# EAGLE design CouchProtato-BOTTOM (EAGLE 9.5.2)
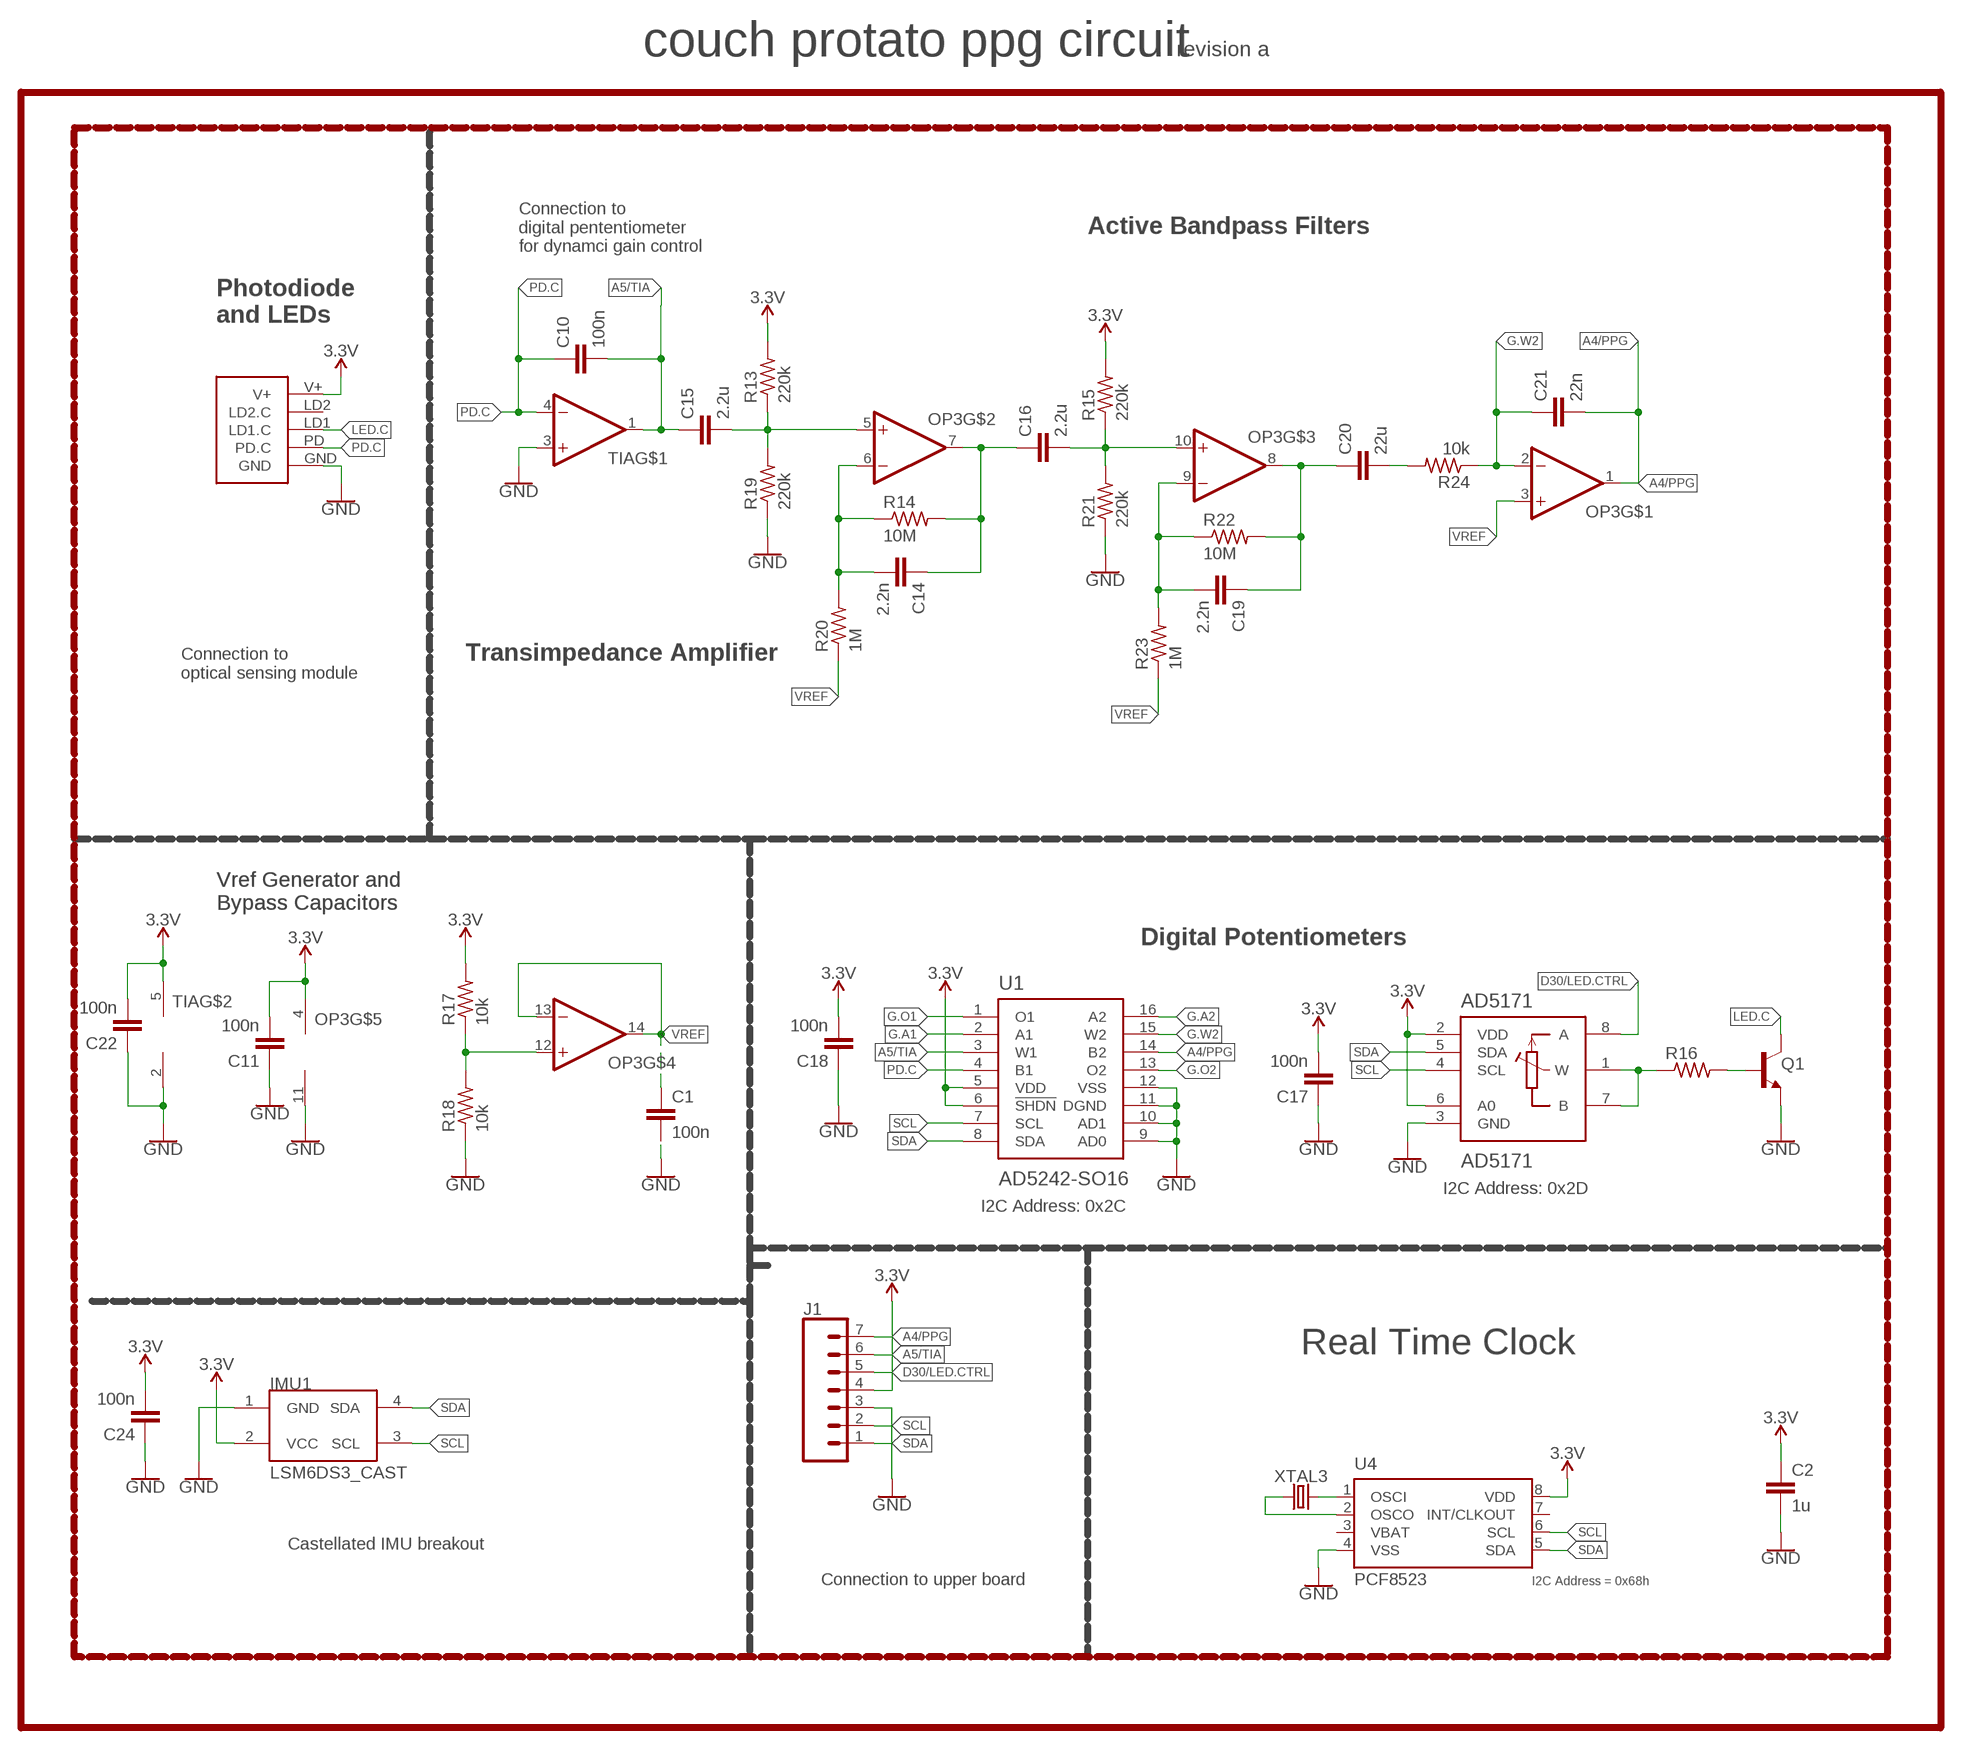
[diagram p0: schematic, sheet 1]

## Parts
AD5171  AD5171  [SOT-23-8]
C1  100n  CAPACITOR0603  [C0603]
C2  1u  CAPACITOR0603  [C0603]
C10  100n  CAPACITOR0603  [C0603]
C11  100n  CAPACITOR0603  [C0603]
C14  2.2n  CAPACITOR0603  [C0603]
C15  2.2u  CAPACITOR0603  [C0603]
C16  2.2u  CAPACITOR0603  [C0603]
C17  100n  CAPACITOR0603  [C0603]
C18  100n  CAPACITOR0603  [C0603]
C19  2.2n  CAPACITOR0603  [C0603]
C20  22u  CAPACITOR0603  [C0603]
C21  22n  CAPACITOR0603  [C0603]
C22  100n  CAPACITOR0603  [C0603]
C24  100n  CAPACITOR0603  [C0603]
IMU1  LSM6DS3_CAST  [LSM6DS3_CAST]
J1  CONN_07-1.27MM  [1X07_1.27MM]
OP3  OP-QUAD-SO14  [SO14]
Q1  NPN-GENERIC  [SOT23-3]
R13  220k  RESISTOR0603  [R0603]
R14  10M  RESISTOR0603  [R0603]
R15  220k  RESISTOR0603  [R0603]
R16  RESISTOR0603  [R0603]
R17  10k  RESISTOR0402  [R0402]
R18  10k  RESISTOR0402  [R0402]
R19  220k  RESISTOR0603  [R0603]
R20  1M  RESISTOR0603  [R0603]
R21  220k  RESISTOR0603  [R0603]
R22  10M  RESISTOR0603  [R0603]
R23  1M  RESISTOR0603  [R0603]
R24  10k  RESISTOR0603  [R0603]
TIA  OP-SINGLEOT  [SOT23-5]
U1  AD5242-SO16  [SO16]
U4  PCF8523  [SO8]
U$3  PPG.MODULE.2  [PPG.MODULE.2]
XTAL3  32.7680kHz  CRYSTALECS-.327-12.5-12-C-TR  [2-SMD.NOLEAD.2.0MMTO1.2MM]

## Nets
3.3V: AD5171.2(VDD) AD5171.6(A0) C2.1 C11.2 C17.2 C18.2 C22.2 C24.2 IMU1.2(VCC) J1.4 OP3.4(V+) R13.2 R15.2 R17.2 TIA.5(V+) U1.5(VDD) U1.6(!SHDN) U4.8(VDD) U$3.V+
A4/PPG: C21.2 J1.7 OP3.1(OUT) U1.14(B2)
A5/TIA: C10.2 C15.1 J1.6 TIA.1(OUT) U1.3(W1)
D30/LED.CTRL: AD5171.8(A) J1.5
G.A1: U1.2(A1)
G.A2: U1.16(A2)
G.O1: U1.1(O1)
G.O2: U1.13(O2)
G.W2: C21.1 OP3.2(-IN) R24.1 U1.15(W2)
GND: AD5171.3(GND) C1.2 C2.2 C11.1 C17.1 C18.1 C22.1 C24.1 IMU1.1(GND) J1.3 OP3.11(V-) Q1.2(E) R18.1 R19.1 R21.1 TIA.2(V-) TIA.3(+IN) U1.9(AD0) U1.10(AD1) U1.11(DGND) U1.12(VSS) U4.4(VSS) U$3.GND
LED.C: Q1.3(C) U$3.LD1(LD1.C)
N$1: U4.2(OSCO) XTAL3.P$1
N$2: U4.1(OSCI) XTAL3.P$2
N$8: Q1.1(B) R16.2
N$9: AD5171.1(W) AD5171.7(B) R16.1
N$10: OP3.12(+IN) R17.1 R18.2
N$13: C15.2 OP3.5(+IN) R13.1 R19.2
N$15: C14.2 OP3.6(-IN) R14.1 R20.2
N$16: C14.1 C16.1 OP3.7(OUT) R14.2
N$17: C16.2 OP3.10(+IN) R15.1 R21.2
N$18: C19.2 OP3.9(-IN) R22.1 R23.2
N$19: C19.1 C20.1 OP3.8(OUT) R22.2
N$20: C20.2 R24.2
PD.C: C10.1 TIA.4(-IN) U1.4(B1) U$3.PD(PD.C)
SCL: AD5171.4(SCL) IMU1.3(SCL) J1.2 U1.7(SCL) U4.6(SCL)
SDA: AD5171.5(SDA) IMU1.4(SDA) J1.1 U1.8(SDA) U4.5(SDA)
VREF: C1.1 OP3.3(+IN) OP3.13(-IN) OP3.14(OUT) R20.1 R23.1
Unconnected: U4.7(INT/CLKOUT) U$3.LD2(LD2.C)

## Notes on the sheet
- couch protato ppg circuit | revision a
- Active Bandpass Filters
- Connection to 
  digital pententiometer 
  for dynamci gain control
- Photodiode
  and LEDs
- Transimpedance Amplifier
- Connection to 
  optical sensing module
- Vref Generator and 
  Bypass Capacitors
- Vref Generator and 
  Bypass Capacitors
- Digital Potentiometers
- I2C Address: 0x2D
- I2C Address: 0x2C
- Real Time Clock
- Castellated IMU breakout
- Connection to upper board | I2C Address = 0x68h

## Power pins joined to a net without a drawn wire
VBAT: U4.3(VBAT)

## Library data of the parts
AD5171 = LinnesLab-DigitalIC:AD5171
C1 C2 C10 C11 C14-C22 C24 = LinnesLab-Passives:CAPACITOR
IMU1 = LinnesLab-Sensors:LSM6DS3_CAST
J1 = LinnesLab-Connectors:CONN_07: Multi connection point. Often used as Generic Header-pin footprint for 0.1 inch spaced/style header connections On any of the 0.1 inch spaced packages, you can populate with these: Break Away Headers - Straight <https://www.sparkfun.com/products/116> (PRT-00116) Break Away Male Headers - Right Angle <https://www.sparkfun.com/products/553> (PRT-00553) Female Headers <https://www.sparkfun.com/products/115> (PRT-00115) Break Away Headers - Machine Pin <https://www.sparkfun.com/products/117> (PRT-00117) Break Away Female Headers - Swiss Machine Pin <https://www.sparkfun.com/products/743> (PRT-00743) For SCREWTERMINALS and SPRING TERMINALS visit here: Screw Terimnals on SparkFun.com <https://www.sparkfun.com/search/results?term=Screw+Terminals> (5mm/3.5mm/2.54mm spacing) This device is also useful as a general connection point to wire up your design to another part of your project. Our various solder wires solder well into these plated through hole pads. Hook-Up Wire - Assortment (Stranded, 22 AWG) <https://www.sparkfun.com/products/11375> (PRT-11375) Hook-Up Wire - Assortment (Solid Core, 22 AWG) <https://www.sparkfun.com/products/11367> (PRT-11367) View the entire wire category on our website here <https://www.sparkfun.com/categories/141> Special notes: Molex polarized connector foot print use with SKU : PRT-08231 with associated crimp pins and housings. 1MM SMD Version SKU: PRT-10208 NOTES ON THE VARIANTS LOCK and LOCK_LONGPADS... This footprint was designed to help hold the alignment of a through-hole component (i.e. 6-pin header) while soldering it into place. You may notice that each hole has been shifted either up or down by 0.005 of an inch from it's more standard position (which is a perfectly straight line). This slight alteration caused the pins (the squares in the middle) to touch the edges of the holes. Because they are alternating, it causes a "brace" to hold the component in place. 0.005 has proven to be the perfect amount of "off-center" position when using our standard breakaway headers. Although looks a little odd when you look at the bare footprint, once you have a header in there, the alteration is very hard to notice. Also,if you push a header all the way into place, it is covered up entirely on the bottom side.
OP3 = LinnesLab-AnalogIC:OP-QUAD: General symbol and footprints for Quad Op Amps. Use with any standard general purpose op amp.
Q1 = LinnesLab-DiscreteSemi:NPN
R13-R24 = LinnesLab-Passives:RESISTOR
TIA = LinnesLab-AnalogIC:OP-SINGLE: Single Op Amp 2.7V to 6.0V Single Supply CMOS Source: http://ww1.microchip.com/downloads/en/DeviceDoc/21314g.pdf
U1 = LinnesLab-DigitalIC:AD5242
U4 = LinnesLab-Clocks:PCF8523; DIGIKEY: 568-5306-1-ND; I2C_ADDRESS: 0x68h; MFN: PCF8523T/1,118; MFN_MANUFACTURER: NXP USA Inc.
U$3 = LinnesLab-Connectors:PPG.MODULE.2: Digi-Key Part Number: S9014E-50-ND Manufacturer Part Number: GRPB501VWVN-RC Description: 1mm insulation height 0.05in pitch 50 positions
XTAL3 = LinnesLab-Clocks:CRYSTAL; DIGIKEY: XC2288CT-ND; FREQ: 32.7680KHZ; LOAD_CAP: 12.5pF

## Board
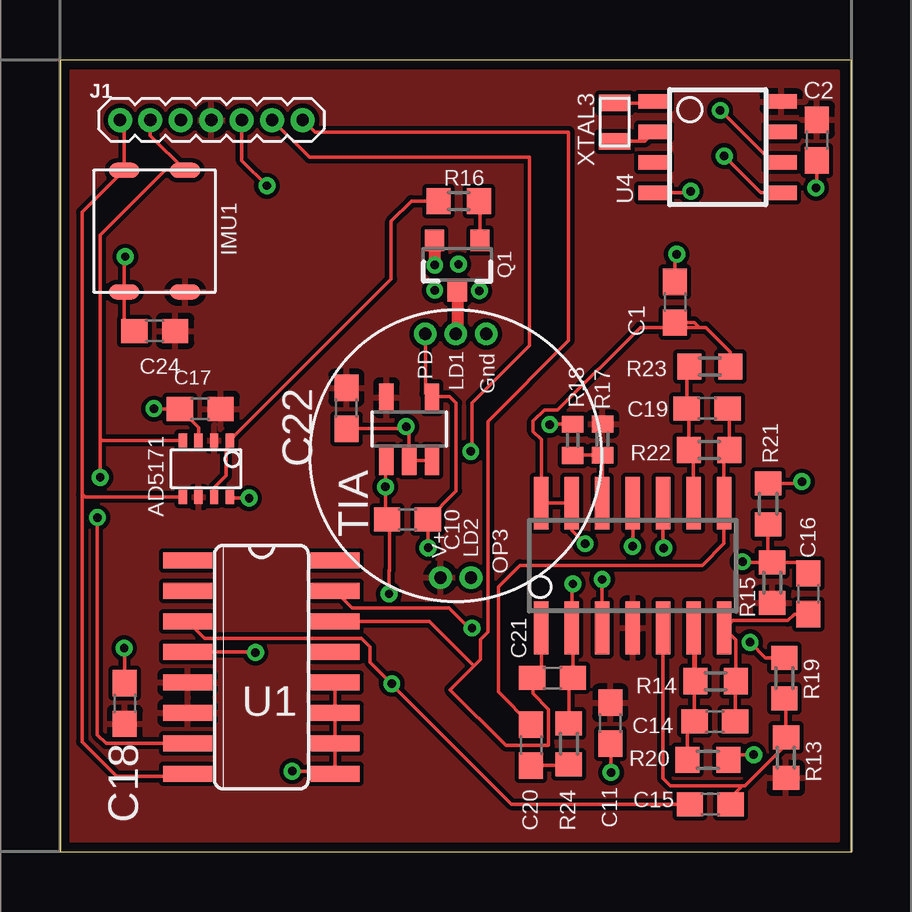
[diagram p1: board, top side]
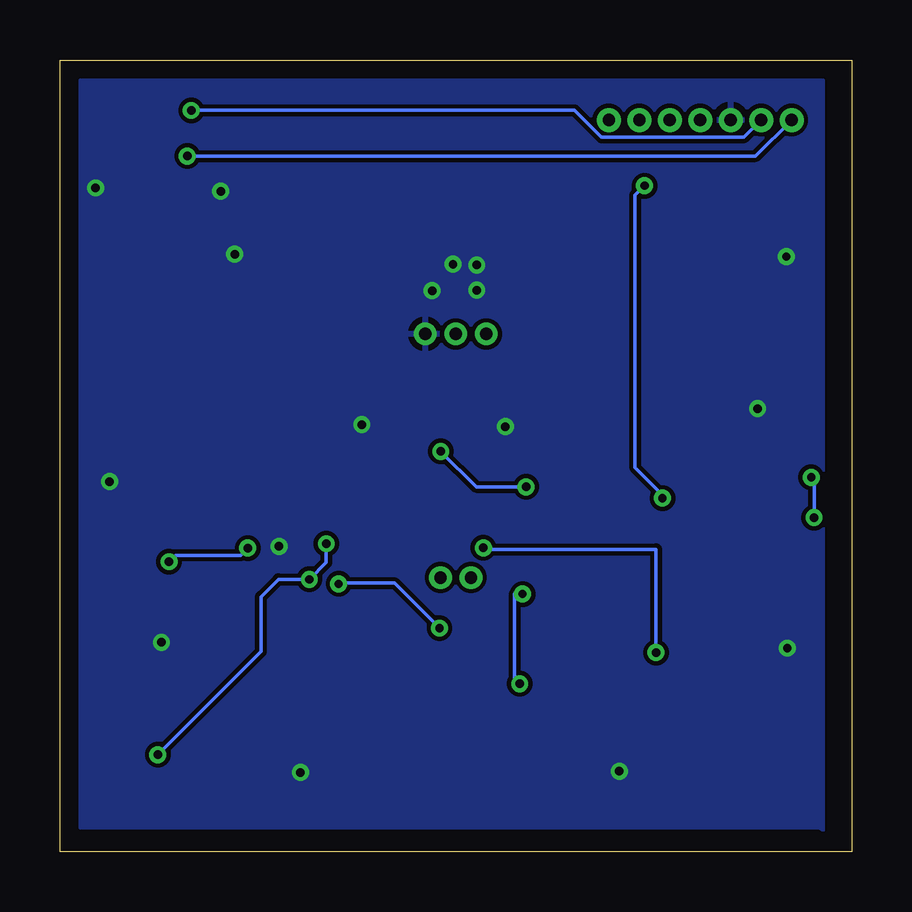
[diagram p2: board, bottom side, seen from below]

Size 33 x 33 mm. Coordinates in mm from the lower left corner, seen from the top.
Outline: 0,0 33,0 33,33 0,33 0,0
Copper layers (1*16): Top 0.0356mm / dielectric 1.5011mm / Bottom 0.0356mm
Design rules "LaenPCBOrder": minimum track width 6mil, minimum drill 13mil, track to track 6mil, track to pad 6mil, pad to pad 6mil, via to via 6mil, smd to smd 6mil, copper to edge 15mil, drill to drill 6mil, minimum pad ring 7mil, minimum via ring 7mil, stop-mask expansion 3mil, vias tented up to drill 0mil, thermal gap 10mil

### Footprints (pad centres in the part's own frame; a part is rotated, then mirrored left to right if it is on the bottom)
SOT-23-8 = smd 0.35 x 0.6: 1 -0.991,-1.176; 2 -0.341,-1.176; 3 0.309,-1.176; 4 0.959,-1.176; 5 0.959,1.176; 6 0.309,1.176; 7 -0.341,1.176; 8 -0.991,1.176
C0603 = smd 1.1 x 1: 1 -0.85,0; 2 0.85,0
LSM6DS3_CAST = smd 0.635 x 1.27: 1 -2.54,1.27; 2 -2.54,-1.27; 3 2.54,-1.27; 4 2.54,1.27
1X07_1.27MM = drill 0.508 pad 1: 1 0,0; 2 1.27,0; 3 2.54,0; 4 3.81,0; 5 5.08,0; 6 6.35,0; 7 7.62,0
SO14 = smd 0.6 x 2.2: 1 -3.81,-2.6; 2 -2.54,-2.6; 3 -1.27,-2.6; 4 0,-2.6; 5 1.27,-2.6; 6 2.54,-2.6; 7 3.81,-2.6; 8 3.81,2.6; 9 2.54,2.6; 10 1.27,2.6; 11 0,2.6; 12 -1.27,2.6; 13 -2.54,2.6; 14 -3.81,2.6
SOT23-3 = smd 0.8 x 0.9: 1 -0.95,-1; 2 0.95,-1; 3 0,1.1
R0603 = smd 1 x 1.1: 1 -0.85,0; 2 0.85,0
R0402 = smd 0.7 x 0.9: 1 -0.65,0; 2 0.65,0
SOT23-5 = smd 0.6 x 1.2: 1 -0.95,-1.306; 2 0,-1.306; 3 0.95,-1.306; 4 0.95,1.306; 5 -0.95,1.306
SO16 = smd 0.66 x 2.032: 1 -4.445,-3.073; 2 -3.175,-3.073; 3 -1.905,-3.073; 4 -0.635,-3.073; 5 0.635,-3.073; 6 1.905,-3.073; 7 3.175,-3.073; 8 4.445,-3.073; 9 4.445,3.073; 10 3.175,3.073; 11 1.905,3.073; 12 0.635,3.073; 13 -0.635,3.073; 14 -1.905,3.073; 15 -3.175,3.073; 16 -4.445,3.073
SO8 = smd 1.3 x 0.6: 1 -2.65,1.905; 2 -2.65,0.635; 3 -2.65,-0.635; 4 -2.65,-1.905; 5 2.65,-1.905; 6 2.65,-0.635; 7 2.65,0.635; 8 2.65,1.905
PPG.MODULE.2 = drill 0.508 pad 0.94: GND 1.27,5.08; LD1 0,5.08; LD2 0.635,-5.08; PD -1.27,5.08; V+ -0.635,-5.08
2-SMD.NOLEAD.2.0MMTO1.2MM = smd 0.7 x 1.3: P$1 -0.8,0; P$2 0.8,0

### Placement (x,y rotation side)
AD5171  6.09,15.96 180 top
C1  25.65,22.9 90 top
C2  31.56,29.66 270 top
C10  14.48,13.85 180 top
C11  22.94,5.35 90 top
C14  27.3,5.42 180 top
C15  27.11,1.98 0 top
C16  31.21,10.74 90 top
C17  5.85,18.45 0 top
C18  2.7,6.17 270 top
C19  26.98,18.48 180 top
C20  19.64,4.44 270 top
C21  20.54,7.24 180 top
C22  11.94,18.48 90 top
C24  3.95,21.7 0 top
IMU1  3.94,25.86 90 top
J1  2.5,30.5 0 top
OP3  23.88,11.92 0 top
Q1  16.57,24.47 180 top
R13  30.27,3.91 270 top
R14  27.33,7.1 0 top
R15  29.69,11.21 270 top
R16  16.63,27.12 0 top
R17  22.62,17.17 90 top
R18  21.38,17.16 270 top
R19  30.2,7.23 270 top
R20  27.01,3.82 180 top
R21  29.52,14.5 270 top
R22  27.07,16.74 0 top
R23  27.09,20.22 180 top
R24  21.21,4.5 270 top
TIA  14.56,17.61 0 top
U1  8.4,7.69 270 top
U4  27.42,29.36 0 top
U$3  16.5,16.5 0 top
XTAL3  23.13,30.41 90 top

### Tracks (layer width: path | path; a pad name or v marks a point on that pad's centre or on a via)
3.3V
  pour Top (isolate 0.178): 0.45,0.37 0.45,32.54 32.45,32.54 32.45,0.45
A4/PPG
  Top 0.152: C21.2 19.71,7.26 | 19.71,7.26 20.07,7.62 OP3.1 | 19.71,7.26 19.71,6.6 20.37,5.93 20.37,4.42 18.6,4.42 16.27,6.75 17.26,7.74 | J1.7 10.63,29.99 21.2,29.99 21.2,21.3 17.83,17.93 17.83,9.15 17.52,8.84 17.52,8 17.26,7.74 | 17.26,7.74 15.4,9.59 U1.14
A5/TIA  (via drill 0.35)
  Top 0.152: TIA.1 13.57,16.26 v13.57,15.2 13.57,13.92 C10.2 13.73,13.75 13.73,11.71 13.72,11.72 v13.72,10.74 | C15.1 18.82,1.98 13.83,6.97 v13.83,7 12.94,7.89 12.94,8.53 12.58,8.88 6.04,8.88 U1.3 | J1.6 10.4,28.95 19.57,28.95 19.57,21.1 17.17,18.7 17.17,16.64 v17.13,16.68
  Bottom 0.152: v13.72,10.74 14.05,10.74 14.05,7.21 v13.83,7 | v17.13,16.68 15.64,15.2 v13.57,15.2
D30/LED.CTRL  (via drill 0.35)
  Top 0.152: v7.88,14.73 7.13,14.73 AD5171.8 | v8.63,27.76 7.58,28.81 J1.5
  Bottom 0.152: v7.88,14.73 7.88,14.87 9.03,16.01 9.03,27.36 v8.63,27.76
G.W2  (via drill 0.35)
  Top 0.152: C21.1 21.39,7.42 | 21.39,7.42 21.39,9.27 | 21.39,9.27 21.42,9.24 21.42,9.33 21.35,9.4 21.35,11.13 v21.38,11.16 | 21.39,9.27 OP3.2 | R24.1 21.21,7.25 21.39,7.42 | U1.15 12.18,10.15 16.22,10.15 17.06,9.31 v17.18,9.31
  Bottom 0.152: v17.18,9.31 19.05,11.19 21.35,11.19 v21.38,11.16
GND  (via drill 0.35)
  Top 0.152: 21.26,17.93 R18.1 21.37,17.82 20.57,17.82 20.5,17.89 v20.42,17.8 | OP3.11 v23.88,12.73 v23.87,12.72 | R21.1 30.85,15.34 v30.93,15.43 | R19.1 29.41,8.08 v28.77,8.72 | C11.1 22.97,4.47 v22.97,3.29 | 2.7,8.45 v2.68,8.48 2.7,8.46 C18.1 | C22.1 14.43,17.63 v14.43,17.71 14.56,17.59 TIA.2 TIA.3 | U1.12 U1.11 U1.10 U1.9 11.37,3.35 v9.68,3.35 | v2.72,24.8 2.67,24.76 IMU1.1 2.67,22.13 C24.1 | AD5171.3 5.78,17.67 C17.1 v3.92,18.45 v3.92,18.46 | C1.2 25.65,24.9 v25.71,24.9 | C2.2 31.56,27.71 v31.51,27.67 | U4.4 26.23,27.46 v26.3,27.53
  Top 0.508: Q1.2 15.61,24.5 v15.62,24.45
  other vias: 15.63,23.4 17.48,23.38 16.61,24.48
  pour Bottom (isolate 0.178): 1.18,0.89 1.18,32.16 32.17,32.16 32.17,0.98 1.37,0.98
LED.C
  Top 0.508: Q1.3 16.57,21.64 U$3.LD1
N$1
  Top 0.152: XTAL3.P$1 24.38,29.61 U4.2
N$2
  Top 0.152: XTAL3.P$2 24.71,31.21 U4.1
N$8
  Top 0.152: Q1.1 17.52,27.08 R16.2
N$9
  Top 0.152: AD5171.7 6.43,15.18 6.92,15.68 6.92,16.77 7.08,16.92 AD5171.1 13.81,23.87 13.81,26.28 14.65,27.12 R16.1
N$10
  Top 0.152: R18.2 21.39,16.52 R17.1 22.62,14.54 OP3.12
N$13
  Top 0.152: R19.2 30.27,6.31 R13.1 30.27,4.46 28.56,2.75 28.46,2.75 | 28.46,2.75 27.96,2.25 C15.2 | OP3.5 25.14,3.04 25.44,2.75 28.46,2.75
N$15
  Top 0.152: R14.1 26.48,9.26 OP3.6 26.42,7.16 R14.1 | R14.1 26.45,7.07 C14.2 26.16,5.13 R20.2
N$16
  Top 0.152: C14.1 28.15,7.07 R14.2 28.18,8.83 27.72,9.29 | 27.72,9.29 OP3.7 | C16.1 30.6,9.89 30.34,9.63 28.05,9.63 27.72,9.29
N$17  (via drill 0.35)
  Top 0.152: R21.2 29.52,12.23 R15.1 | R15.1 30.74,12.06 C16.2 | R15.1 28.48,12.06 v28.45,12.09 | OP3.10 25.14,12.67 v25.17,12.65
  Bottom 0.152: v25.17,12.65 25.46,12.35 28.18,12.35 v28.45,12.09
N$18
  Top 0.152: OP3.9 26.41,16.54 R22.1 26.22,18.39 C19.2 26.13,20.11 R23.2
N$19
  Top 0.152: C20.1 18.28,6.65 18.28,11.04 19.17,11.93 26.77,11.93 27.68,12.84 OP3.8 27.68,16.51 R22.2 27.92,18.39 C19.1
N$20
  Top 0.152: C20.2 21.16,3.59 R24.2
PD.C  (via drill 0.35)
  Top 0.152: U$3.PD 15.23,19.09 15.34,18.98 15.46,18.98 | 15.46,18.98 TIA.4 | 15.46,18.98 16.24,18.98 16.52,18.69 16.52,15.04 C10.1 15.35,13.84 v15.35,12.66 | v8.15,8.3 8.12,8.32 U1.4
  Bottom 0.152: v15.35,12.66 15.28,12.6 8.15,12.6 v8.15,8.3
SCL  (via drill 0.35)
  Top 0.152: J1.2 3.77,29.85 IMU1.3 4.39,28.4 1.68,25.69 1.68,17.23 | U1.7 1.92,4.51 1.56,4.87 v1.56,13.92 | v1.68,15.6 1.68,17.23 | AD5171.4 1.77,17.14 1.68,17.23 | U4.6 29.69,28.73 v27.52,30.9
  Bottom 0.152: v1.56,13.92 1.56,15.48 v1.68,15.6 | v27.52,30.9 11.55,30.9 10.42,29.77 4.5,29.77 J1.2
SDA  (via drill 0.35)
  Top 0.152: J1.1 2.67,30.33 IMU1.4 0.92,26.65 0.92,14.9 | U1.8 5.21,3.13 2.37,3.13 0.92,4.58 0.92,14.9 | AD5171.5 1.05,14.78 0.92,14.9 | U4.5 29.23,27.46 v27.69,28.99
  Bottom 0.152: v27.69,28.99 4.01,28.99 J1.1
VREF  (via drill 0.35)
  Top 0.152: 26.65,21.85 24.19,21.85 20.74,18.4 20.19,18.4 19.73,17.94 19.73,17.51 20.07,17.17 OP3.14 OP3.13 21.34,13.39 v21.9,12.83 | 26.65,21.85 26.93,21.85 27.94,20.83 R23.1 | R20.1 28.07,4.03 v28.92,4.03 | v22.6,11.35 OP3.3 | C1.1 26.45,22.05 26.65,21.85
  Bottom 0.152: v28.92,4.03 24.62,8.34 24.62,10.62 23.89,11.35 v22.6,11.35 21.9,12.05 v21.9,12.83